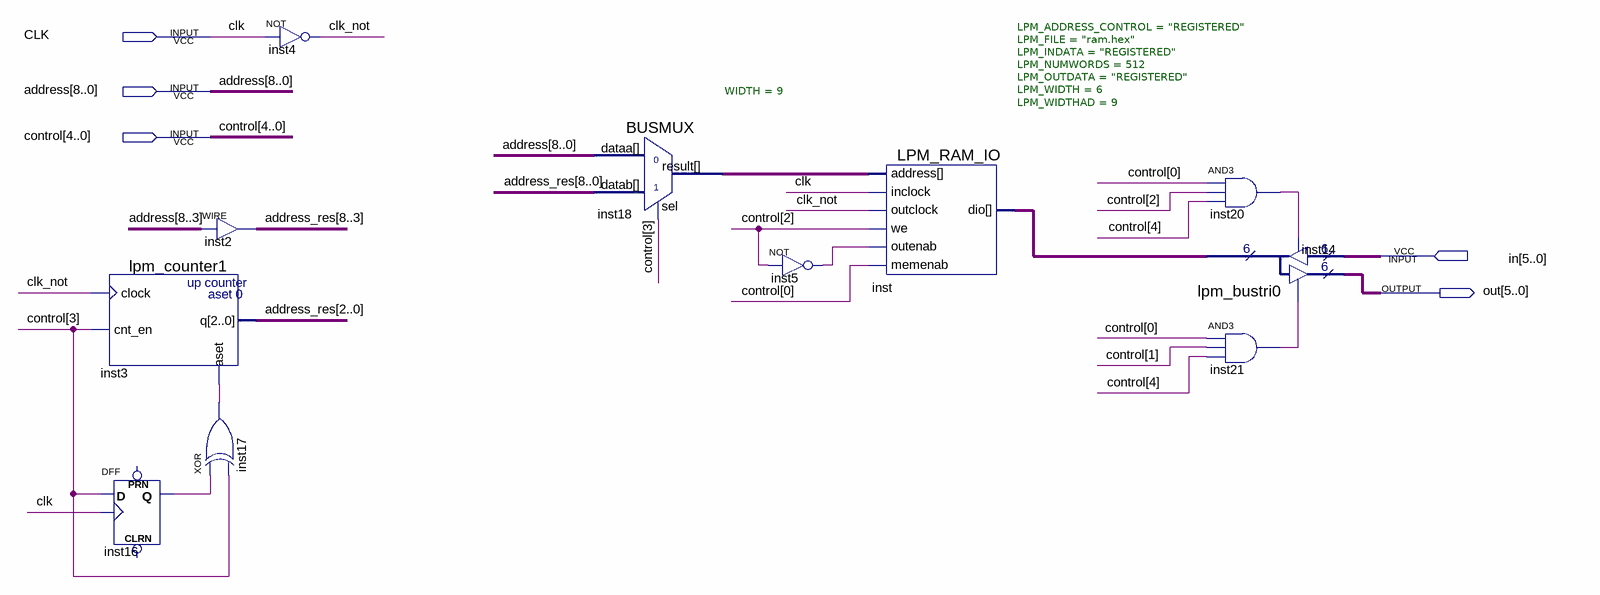
[diagram p0: schematic sheet]
// Quartus schematic Memory.bdf as structural Verilog: 11 symbols, 5 pins
module Memory (
  input  CLK,
  input  [8:0] address,
  input  [4:0] control,
  input  [5:0] in,
  output [5:0] out
);

  wire clk_not, inst5_out, inst16_q, inst17_out, inst20_out, inst21_out;
  wire [5:0] inst_dio;
  wire [8:0] address_res, inst18_result;

  lpm_counter1 inst3 (.clock(clk_not), .cnt_en(control[3]), .aset(inst17_out), .q(address_res[2:0]));
  DFF inst16 (.CLK(CLK), .D(control[3]), .Q(inst16_q));  // open: CLRN, PRN
  assign address_res[8:3] = address[8:3];  // WIRE inst2
  xor inst17 (inst17_out, inst16_q, control[3]);
  not inst4 (clk_not, CLK);
  BUSMUX #(.WIDTH(9)) inst18 (.datab(address_res), .sel(control[3]), .dataa(address), .result(inst18_result));
  not inst5 (inst5_out, control[2]);
  LPM_RAM_IO #(.LPM_ADDRESS_CONTROL("REGISTERED"), .LPM_FILE("ram.hex"), .LPM_INDATA("REGISTERED"), .LPM_NUMWORDS(512), .LPM_OUTDATA("REGISTERED"), .LPM_WIDTH(6), .LPM_WIDTHAD(9)) inst (
    .address(inst18_result), .outclock(clk_not), .memenab(control[0]), .inclock(CLK), .we(control[2]),
    .outenab(inst5_out), .dio(inst_dio));
  and inst20 (inst20_out, control[0], control[2], control[4]);
  lpm_bustri0 inst14 (.enabledt(inst20_out), .data(in), .enabletr(inst21_out), .result(out), .tridata(inst_dio));
  and inst21 (inst21_out, control[0], control[1], control[4]);
endmodule
